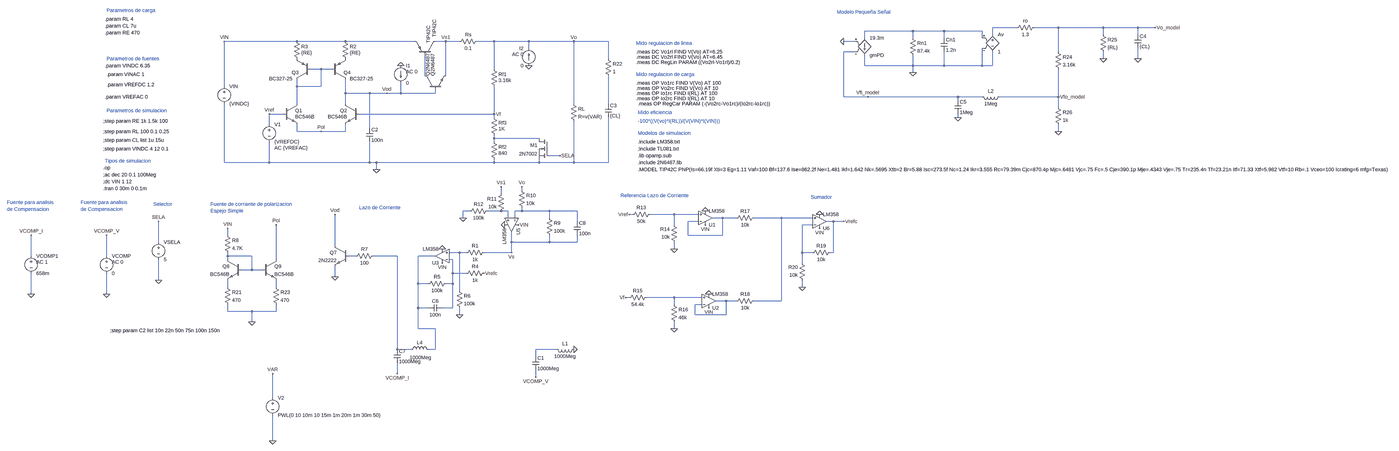
[diagram p0: schematic Regulador_LDOA_v6.asc, whole sheet]
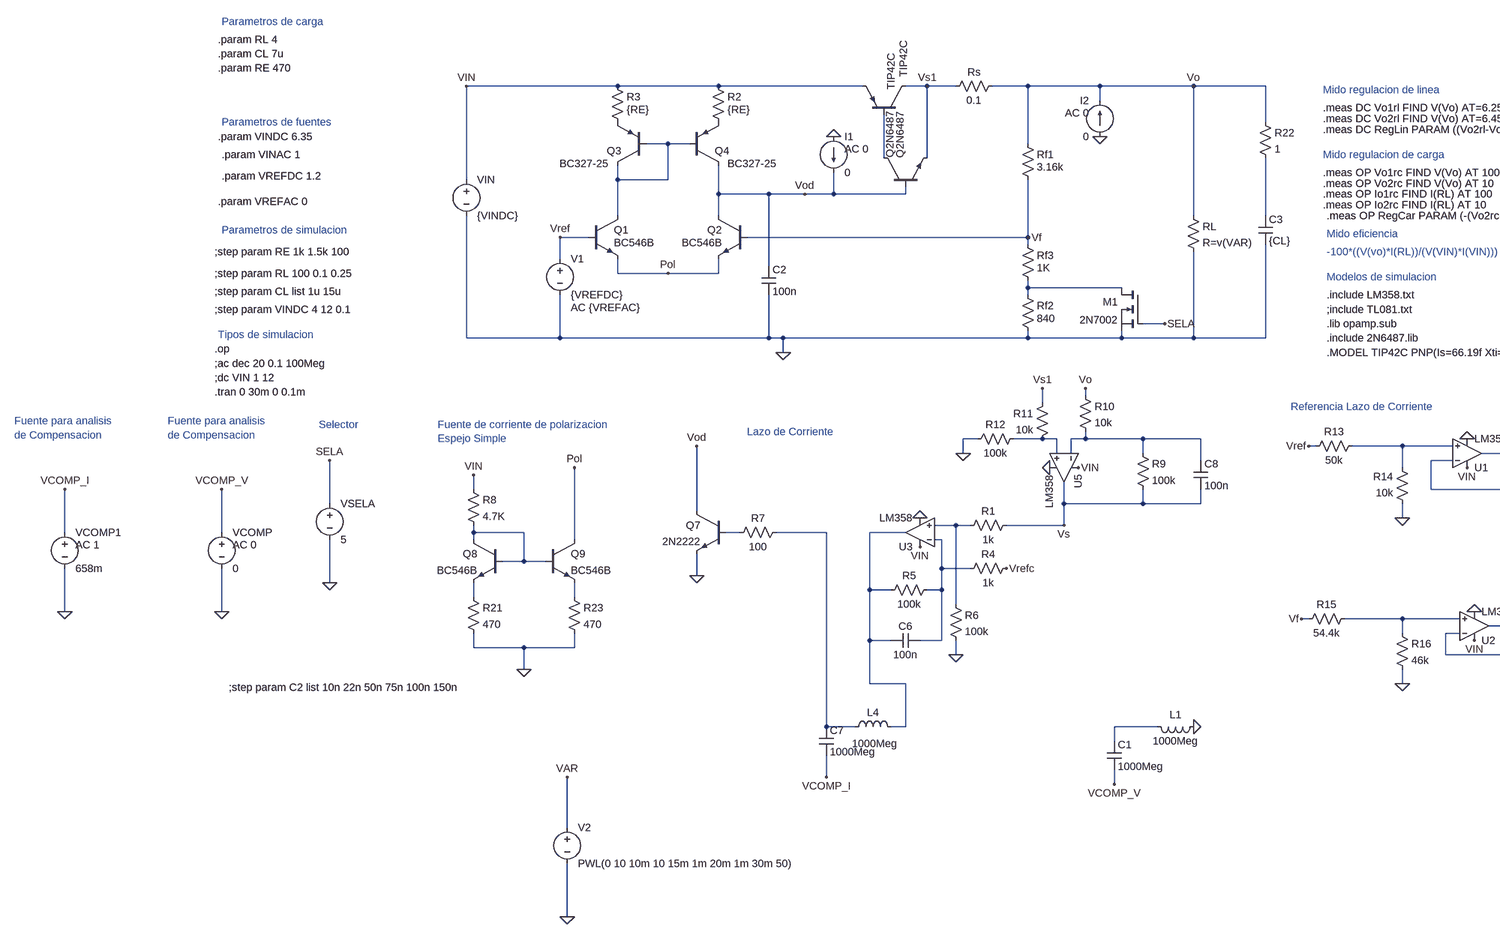
[diagram p1: schematic Regulador_LDOA_v6.asc, part, row 1 of 1, column 1 of 2]
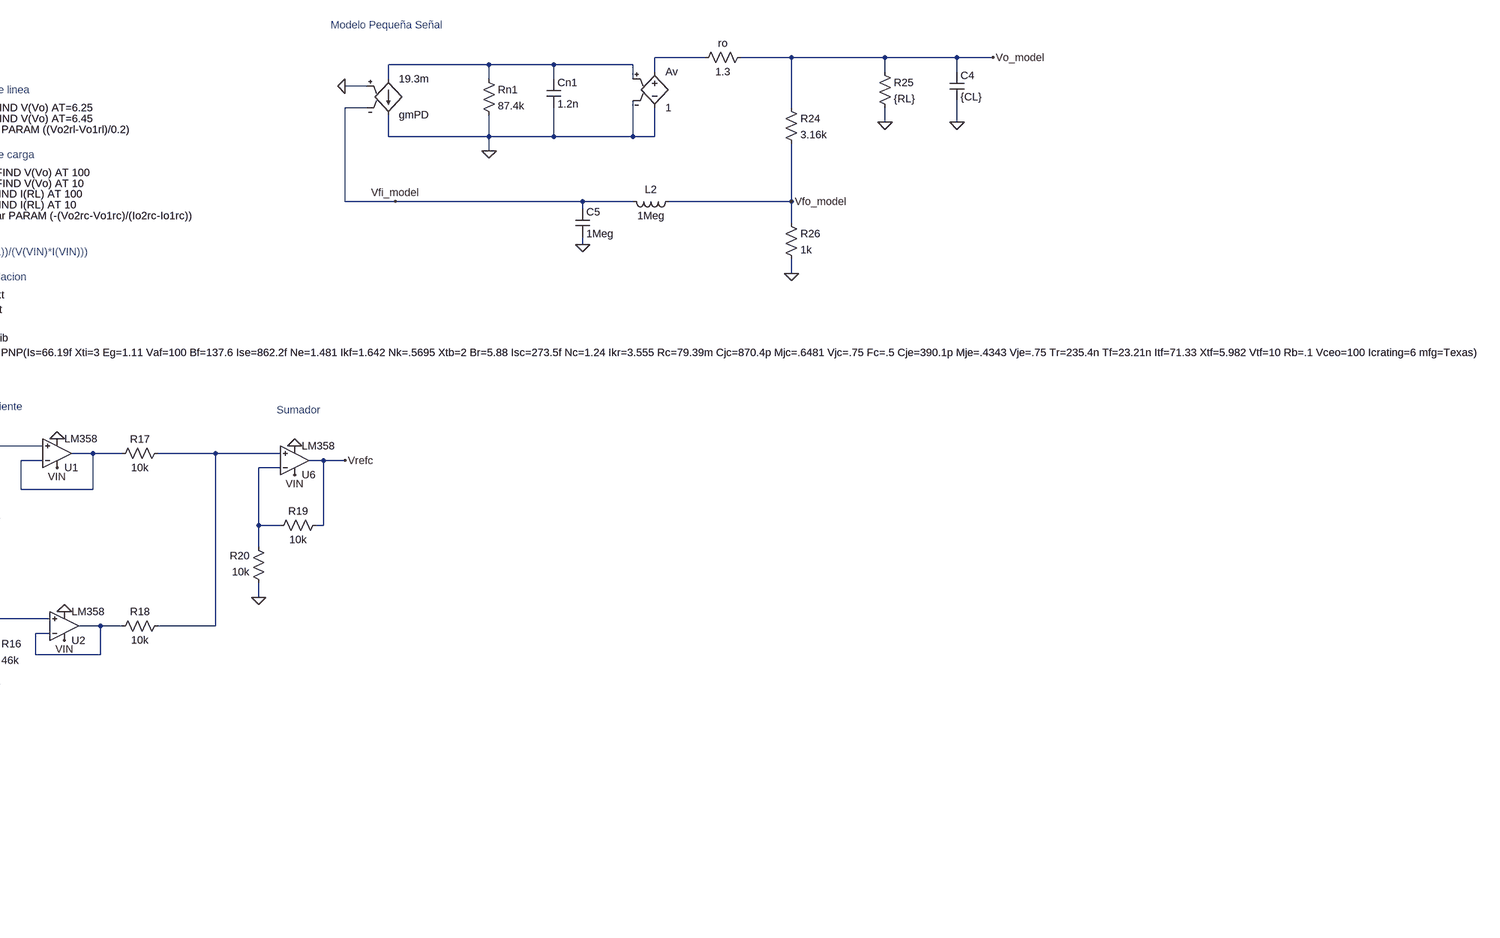
[diagram p2: schematic Regulador_LDOA_v6.asc, part, row 1 of 1, column 2 of 2]
Regulador_LDOA_v6.asc, the LTspice schematic file:
Version 4
SHEET 1 2316 856
WIRE -5360 -2448 -5472 -2448
WIRE -5168 -2448 -5280 -2448
WIRE -4960 -2448 -5168 -2448
WIRE -4800 -2448 -4960 -2448
WIRE -4720 -2448 -4800 -2448
WIRE -5840 -2432 -6064 -2432
WIRE -5696 -2432 -5840 -2432
WIRE -5520 -2432 -5696 -2432
WIRE -5472 -2416 -5472 -2448
WIRE -4960 -2416 -4960 -2448
WIRE -4800 -2416 -4800 -2448
WIRE -6064 -2400 -6064 -2432
WIRE -5840 -2400 -5840 -2432
WIRE -5696 -2400 -5696 -2432
WIRE -5520 -2400 -5520 -2432
WIRE -8688 -2384 -9024 -2384
WIRE -8464 -2384 -8688 -2384
WIRE -8144 -2384 -8464 -2384
WIRE -8000 -2384 -8048 -2384
WIRE -7936 -2384 -8000 -2384
WIRE -7776 -2384 -7856 -2384
WIRE -7616 -2384 -7776 -2384
WIRE -7408 -2384 -7616 -2384
WIRE -7248 -2384 -7408 -2384
WIRE -6112 -2384 -6160 -2384
WIRE -7616 -2352 -7616 -2384
WIRE -6112 -2336 -6160 -2336
WIRE -5168 -2336 -5168 -2448
WIRE -7248 -2304 -7248 -2384
WIRE -4960 -2304 -4960 -2336
WIRE -4800 -2304 -4800 -2352
WIRE -6064 -2272 -6064 -2320
WIRE -5840 -2272 -5840 -2320
WIRE -5840 -2272 -6064 -2272
WIRE -5696 -2272 -5696 -2336
WIRE -5696 -2272 -5840 -2272
WIRE -5520 -2272 -5520 -2352
WIRE -5520 -2272 -5696 -2272
WIRE -5472 -2272 -5472 -2336
WIRE -5472 -2272 -5520 -2272
WIRE -8576 -2256 -8624 -2256
WIRE -8528 -2256 -8576 -2256
WIRE -7776 -2256 -7776 -2384
WIRE -5840 -2240 -5840 -2272
WIRE -8096 -2224 -8096 -2320
WIRE -8000 -2224 -8000 -2384
WIRE -9024 -2176 -9024 -2384
WIRE -8688 -2176 -8688 -2208
WIRE -8576 -2176 -8576 -2256
WIRE -8576 -2176 -8688 -2176
WIRE -8464 -2144 -8464 -2208
WIRE -8352 -2144 -8464 -2144
WIRE -8272 -2144 -8352 -2144
WIRE -8208 -2144 -8208 -2192
WIRE -8208 -2144 -8272 -2144
WIRE -8048 -2144 -8048 -2160
WIRE -8048 -2144 -8208 -2144
WIRE -6160 -2128 -6160 -2336
WIRE -6048 -2128 -6160 -2128
WIRE -5632 -2128 -6048 -2128
WIRE -5520 -2128 -5632 -2128
WIRE -5168 -2128 -5168 -2256
WIRE -5168 -2128 -5440 -2128
WIRE -5632 -2112 -5632 -2128
WIRE -8688 -2096 -8688 -2176
WIRE -8464 -2096 -8464 -2144
WIRE -7408 -2096 -7408 -2384
WIRE -7248 -2096 -7248 -2224
WIRE -5168 -2080 -5168 -2128
WIRE -8752 -2048 -8816 -2048
WIRE -7776 -2048 -7776 -2176
WIRE -7776 -2048 -8400 -2048
WIRE -7776 -2032 -7776 -2048
WIRE -5632 -2032 -5632 -2048
WIRE -8816 -2000 -8816 -2048
WIRE -8352 -1984 -8352 -2144
WIRE -8688 -1968 -8688 -2000
WIRE -8576 -1968 -8688 -1968
WIRE -8464 -1968 -8464 -2000
WIRE -8464 -1968 -8576 -1968
WIRE -5168 -1968 -5168 -2000
WIRE -7776 -1936 -7776 -1952
WIRE -7568 -1936 -7776 -1936
WIRE -7776 -1920 -7776 -1936
WIRE -7472 -1856 -7520 -1856
WIRE -9024 -1824 -9024 -2096
WIRE -8816 -1824 -8816 -1920
WIRE -8816 -1824 -9024 -1824
WIRE -8352 -1824 -8352 -1920
WIRE -8352 -1824 -8816 -1824
WIRE -8320 -1824 -8352 -1824
WIRE -7776 -1824 -7776 -1840
WIRE -7776 -1824 -8320 -1824
WIRE -7568 -1824 -7568 -1840
WIRE -7568 -1824 -7776 -1824
WIRE -7408 -1824 -7408 -2016
WIRE -7408 -1824 -7568 -1824
WIRE -7248 -1824 -7248 -2032
WIRE -7248 -1824 -7408 -1824
WIRE -8320 -1792 -8320 -1824
WIRE -7648 -1696 -7648 -1712
WIRE -7744 -1680 -7744 -1712
WIRE -7888 -1600 -7920 -1600
WIRE -7744 -1600 -7808 -1600
WIRE -7712 -1600 -7744 -1600
WIRE -7648 -1600 -7648 -1616
WIRE -7648 -1600 -7680 -1600
WIRE -7520 -1600 -7648 -1600
WIRE -7392 -1600 -7520 -1600
WIRE -7136 -1584 -7152 -1584
WIRE -6944 -1584 -7056 -1584
WIRE -6832 -1584 -6944 -1584
WIRE -7920 -1568 -7920 -1600
WIRE -7712 -1568 -7712 -1600
WIRE -7680 -1568 -7680 -1600
WIRE -7520 -1568 -7520 -1600
WIRE -6720 -1568 -6768 -1568
WIRE -6656 -1568 -6720 -1568
WIRE -6448 -1568 -6576 -1568
WIRE -6304 -1568 -6448 -1568
WIRE -7392 -1552 -7392 -1600
WIRE -6832 -1552 -6880 -1552
WIRE -6208 -1552 -6240 -1552
WIRE -6160 -1552 -6208 -1552
WIRE -6944 -1536 -6944 -1584
WIRE -6304 -1536 -6352 -1536
WIRE -9008 -1488 -9008 -1520
WIRE -6880 -1488 -6880 -1552
WIRE -6720 -1488 -6720 -1568
WIRE -6720 -1488 -6880 -1488
WIRE -9328 -1456 -9328 -1552
WIRE -7696 -1456 -7696 -1504
WIRE -7520 -1456 -7520 -1488
WIRE -7520 -1456 -7696 -1456
WIRE -7392 -1456 -7392 -1488
WIRE -7392 -1456 -7520 -1456
WIRE -8512 -1440 -8512 -1584
WIRE -6944 -1424 -6944 -1456
WIRE -7936 -1408 -7984 -1408
WIRE -7904 -1408 -7936 -1408
WIRE -7696 -1408 -7696 -1456
WIRE -7696 -1408 -7824 -1408
WIRE -6352 -1408 -6352 -1536
WIRE -6304 -1408 -6352 -1408
WIRE -6208 -1408 -6208 -1552
WIRE -6208 -1408 -6224 -1408
WIRE -9920 -1392 -9920 -1488
WIRE -9568 -1392 -9568 -1488
WIRE -9008 -1392 -9008 -1408
WIRE -8896 -1392 -9008 -1392
WIRE -8416 -1392 -8448 -1392
WIRE -8224 -1392 -8336 -1392
WIRE -8048 -1392 -8128 -1392
WIRE -9008 -1376 -9008 -1392
WIRE -8784 -1376 -8784 -1536
WIRE -7968 -1376 -7984 -1376
WIRE -6352 -1360 -6352 -1408
WIRE -8896 -1328 -8896 -1392
WIRE -8896 -1328 -8944 -1328
WIRE -8848 -1328 -8896 -1328
WIRE -7968 -1312 -7968 -1376
WIRE -7904 -1312 -7968 -1312
WIRE -8512 -1296 -8512 -1344
WIRE -9328 -1280 -9328 -1376
WIRE -8128 -1264 -8128 -1392
WIRE -8080 -1264 -8128 -1264
WIRE -7968 -1264 -7968 -1312
WIRE -7968 -1264 -8000 -1264
WIRE -9008 -1248 -9008 -1280
WIRE -8784 -1248 -8784 -1280
WIRE -6352 -1248 -6352 -1280
WIRE -7936 -1232 -7936 -1408
WIRE -9920 -1216 -9920 -1312
WIRE -9568 -1216 -9568 -1312
WIRE -7152 -1200 -7168 -1200
WIRE -6944 -1200 -7072 -1200
WIRE -6816 -1200 -6944 -1200
WIRE -6704 -1184 -6752 -1184
WIRE -6656 -1184 -6704 -1184
WIRE -6448 -1184 -6448 -1568
WIRE -6448 -1184 -6576 -1184
WIRE -6944 -1168 -6944 -1200
WIRE -6816 -1168 -6848 -1168
WIRE -8128 -1152 -8128 -1264
WIRE -8080 -1152 -8128 -1152
WIRE -7968 -1152 -7968 -1264
WIRE -7968 -1152 -8016 -1152
WIRE -9008 -1136 -9008 -1168
WIRE -8896 -1136 -9008 -1136
WIRE -8784 -1136 -8784 -1168
WIRE -8784 -1136 -8896 -1136
WIRE -7936 -1120 -7936 -1152
WIRE -6848 -1120 -6848 -1168
WIRE -6704 -1120 -6704 -1184
WIRE -6704 -1120 -6848 -1120
WIRE -8896 -1088 -8896 -1136
WIRE -8128 -1056 -8128 -1152
WIRE -8048 -1056 -8128 -1056
WIRE -6944 -1056 -6944 -1088
WIRE -8224 -960 -8224 -1392
WIRE -8160 -960 -8224 -960
WIRE -8048 -960 -8048 -1056
WIRE -8048 -960 -8080 -960
WIRE -7488 -960 -7584 -960
WIRE -7584 -928 -7584 -960
WIRE -8224 -848 -8224 -896
WIRE -7584 -832 -7584 -864
WIRE -8800 -736 -8800 -848
WIRE -8800 -528 -8800 -656
FLAG -8320 -1792 0
FLAG -7408 -2384 Vo
FLAG -8816 -2048 Vref
FLAG -9024 -2384 VIN
FLAG -7776 -2048 Vf
FLAG -8000 -2384 Vs1
FLAG -7936 -1120 0
FLAG -8272 -2144 Vod
FLAG -7824 -1312 Vrefc
FLAG -7920 -1568 0
FLAG -6352 -1248 0
FLAG -6944 -1056 0
FLAG -6944 -1424 0
FLAG -7472 -1856 SELA
FLAG -9328 -1552 SELA
FLAG -9328 -1280 0
FLAG -6160 -1552 Vrefc
FLAG -7696 -1408 Vs
FLAG -8512 -1296 0
FLAG -8576 -1968 Pol
FLAG -8784 -1536 Pol
FLAG -7584 -832 VCOMP_V
FLAG -9568 -1488 VCOMP_V
FLAG -9568 -1216 0
FLAG -4960 -2304 0
FLAG -4800 -2304 0
FLAG -5168 -1968 0
FLAG -5840 -2240 0
FLAG -5168 -2128 Vfo_model
FLAG -6048 -2128 Vfi_model
FLAG -4720 -2448 Vo_model
FLAG -8896 -1088 0
FLAG -8208 -2272 0
FLAG -7616 -2272 0
FLAG -6160 -2384 0
FLAG -5632 -2032 0
FLAG -7744 -1712 Vs1
FLAG -7648 -1712 Vo
FLAG -8512 -1584 Vod
FLAG -7152 -1584 Vref
FLAG -7168 -1200 Vf
FLAG -8224 -848 VCOMP_I
FLAG -9920 -1488 VCOMP_I
FLAG -9920 -1216 0
FLAG -6272 -1584 0
FLAG -6272 -1520 VIN
FLAG -6800 -1600 0
FLAG -6800 -1536 VIN
FLAG -6784 -1216 0
FLAG -6784 -1152 VIN
FLAG -8016 -1424 0
FLAG -8016 -1360 VIN
FLAG -7728 -1536 0
FLAG -7664 -1536 VIN
FLAG -9008 -1520 VIN
FLAG -7408 -960 0
FLAG -8800 -528 0
FLAG -8800 -848 VAR
DATAFLAG -7536 -2384 ""
DATAFLAG -7584 -960 ""
SYMBOL pnp -8624 -2208 R180
WINDOW 3 84 4 Left 2
SYMATTR Value BC327-25
SYMATTR InstName Q3
SYMBOL pnp -8528 -2208 M180
WINDOW 3 84 4 Left 2
SYMATTR Value BC327-25
SYMATTR InstName Q4
SYMBOL npn -8752 -2096 R0
WINDOW 3 56 60 Left 2
SYMATTR Value BC546B
SYMATTR InstName Q1
SYMBOL npn -8400 -2096 M0
WINDOW 3 56 60 Left 2
SYMATTR Value BC546B
SYMATTR InstName Q2
SYMBOL pnp -8048 -2320 M270
WINDOW 3 84 4 Left 2
SYMATTR Value TIP42C
SYMATTR InstName TIP42C
SYMBOL npn -8096 -2160 R270
WINDOW 3 65 14 Left 2
WINDOW 0 64 36 Left 2
SYMATTR Value Q2N6487
SYMATTR InstName Q2N6487
SYMBOL res -7792 -2272 R0
WINDOW 3 36 68 Left 2
SYMATTR Value 3.16k
SYMATTR InstName Rf1
SYMBOL res -7792 -1936 R0
WINDOW 3 36 68 Left 2
SYMATTR Value 840
SYMATTR InstName Rf2
SYMBOL res -7424 -2112 R0
SYMATTR InstName RL
SYMATTR Value R=v(VAR)
SYMBOL voltage -8816 -2016 R0
WINDOW 123 24 124 Left 2
WINDOW 39 0 0 Left 2
SYMATTR Value2 AC {VREFAC}
SYMATTR InstName V1
SYMATTR Value {VREFDC}
SYMBOL voltage -9024 -2192 R0
WINDOW 123 24 124 Left 2
WINDOW 39 0 0 Left 2
SYMATTR InstName VIN
SYMATTR Value {VINDC}
SYMBOL res -8704 -2400 R0
WINDOW 3 36 68 Left 2
SYMATTR Value {RE}
SYMATTR InstName R3
SYMBOL res -8480 -2400 R0
WINDOW 3 36 68 Left 2
SYMATTR Value {RE}
SYMATTR InstName R2
SYMBOL cap -7264 -2096 R0
SYMATTR InstName C3
SYMATTR Value {CL}
SYMBOL res -7840 -2400 R90
WINDOW 0 0 56 VBottom 2
WINDOW 3 32 56 VTop 2
SYMATTR InstName Rs
SYMATTR Value 0.1
SYMBOL res -7808 -1424 R90
WINDOW 0 0 56 VBottom 2
WINDOW 3 32 56 VTop 2
SYMATTR InstName R1
SYMATTR Value 1k
SYMBOL res -7808 -1328 R90
WINDOW 0 0 56 VBottom 2
WINDOW 3 32 56 VTop 2
SYMATTR InstName R4
SYMATTR Value 1k
SYMBOL res -7984 -1280 R90
WINDOW 0 0 56 VBottom 2
WINDOW 3 32 56 VTop 2
SYMATTR InstName R5
SYMATTR Value 100k
SYMBOL res -7952 -1248 R0
SYMATTR InstName R6
SYMATTR Value 100k
SYMBOL npn -8448 -1440 M0
SYMATTR InstName Q7
SYMATTR Value 2N2222
SYMBOL res -7536 -1584 R0
SYMATTR InstName R9
SYMATTR Value 100k
SYMBOL res -7664 -1712 R0
SYMATTR InstName R10
SYMATTR Value 10k
SYMBOL res -7728 -1696 M0
SYMATTR InstName R11
SYMATTR Value 10k
SYMBOL res -7792 -1616 R90
WINDOW 0 0 56 VBottom 2
WINDOW 3 32 56 VTop 2
SYMATTR InstName R12
SYMATTR Value 100k
SYMBOL res -7040 -1600 R90
WINDOW 0 0 56 VBottom 2
WINDOW 3 32 56 VTop 2
SYMATTR InstName R13
SYMATTR Value 50k
SYMBOL res -6928 -1440 R180
WINDOW 0 36 76 Left 2
WINDOW 3 36 40 Left 2
SYMATTR InstName R14
SYMATTR Value 10k
SYMBOL res -7168 -1184 R270
WINDOW 0 32 56 VTop 2
WINDOW 3 0 56 VBottom 2
SYMATTR InstName R15
SYMATTR Value 54.4k
SYMBOL res -6960 -1184 R0
SYMATTR InstName R16
SYMATTR Value 46k
SYMBOL res -6560 -1584 R90
WINDOW 0 0 56 VBottom 2
WINDOW 3 32 56 VTop 2
SYMATTR InstName R17
SYMATTR Value 10k
SYMBOL res -6560 -1200 R90
WINDOW 0 0 56 VBottom 2
WINDOW 3 32 56 VTop 2
SYMATTR InstName R18
SYMATTR Value 10k
SYMBOL res -6208 -1424 R90
WINDOW 0 0 56 VBottom 2
WINDOW 3 32 56 VTop 2
SYMATTR InstName R19
SYMATTR Value 10k
SYMBOL res -6336 -1264 R180
WINDOW 0 36 76 Left 2
WINDOW 3 36 40 Left 2
SYMATTR InstName R20
SYMATTR Value 10k
SYMBOL res -7792 -2048 R0
WINDOW 3 36 68 Left 2
SYMATTR Value 1K
SYMATTR InstName Rf3
SYMBOL nmos -7520 -1936 M0
SYMATTR InstName M1
SYMATTR Value 2N7002
SYMBOL voltage -9328 -1472 R0
WINDOW 123 0 0 Left 2
WINDOW 39 0 0 Left 2
SYMATTR InstName VSELA
SYMATTR Value 5
SYMBOL res -8320 -1408 R90
WINDOW 0 0 56 VBottom 2
WINDOW 3 32 56 VTop 2
SYMATTR InstName R7
SYMATTR Value 100
SYMBOL npn -8944 -1376 M0
SYMATTR InstName Q8
SYMATTR Value BC546B
SYMBOL res -9024 -1504 R0
SYMATTR InstName R8
SYMATTR Value 4.7K
SYMBOL ind -7392 -976 R90
WINDOW 0 5 56 VBottom 2
WINDOW 3 32 56 VTop 2
SYMATTR InstName L1
SYMATTR Value 1000Meg
SYMBOL cap -7600 -928 R0
SYMATTR InstName C1
SYMATTR Value 1000Meg
SYMBOL voltage -9568 -1408 R0
WINDOW 123 24 44 Left 2
WINDOW 39 0 0 Left 2
SYMATTR Value2 AC 0
SYMATTR InstName VCOMP
SYMATTR Value 0
SYMBOL g2 -6064 -2304 M180
SYMATTR InstName gmPD
SYMATTR Value 19.3m
SYMBOL res -5856 -2416 R0
SYMATTR InstName Rn1
SYMATTR Value 87.4k
SYMBOL cap -5712 -2400 R0
SYMATTR InstName Cn1
SYMATTR Value 1.2n
SYMBOL e -5472 -2432 R0
SYMATTR InstName Av
SYMATTR Value 1
SYMBOL res -5264 -2464 R90
WINDOW 0 0 56 VBottom 2
WINDOW 3 32 56 VTop 2
SYMATTR InstName ro
SYMATTR Value 1.3
SYMBOL res -5184 -2352 R0
SYMATTR InstName R24
SYMATTR Value 3.16k
SYMBOL res -4976 -2432 R0
SYMATTR InstName R25
SYMATTR Value {RL}
SYMBOL cap -4816 -2416 R0
SYMATTR InstName C4
SYMATTR Value {CL}
SYMBOL cap -5648 -2112 R0
SYMATTR InstName C5
SYMATTR Value 1Meg
SYMBOL ind -5424 -2144 R90
WINDOW 0 5 56 VBottom 2
WINDOW 3 32 56 VTop 2
SYMATTR InstName L2
SYMATTR Value 1Meg
SYMBOL res -5184 -2096 R0
SYMATTR InstName R26
SYMATTR Value 1k
SYMBOL npn -8848 -1376 R0
SYMATTR InstName Q9
SYMATTR Value BC546B
SYMBOL current -8208 -2272 R0
WINDOW 123 24 28 Left 2
WINDOW 39 0 0 Left 2
SYMATTR Value2 AC 0
SYMATTR InstName I1
SYMATTR Value 0
SYMBOL current -7616 -2272 R180
WINDOW 0 24 80 Left 2
WINDOW 3 24 0 Left 2
WINDOW 123 24 52 Left 2
WINDOW 39 0 0 Left 2
SYMATTR InstName I2
SYMATTR Value 0
SYMATTR Value2 AC 0
SYMBOL ind -8176 -944 R270
WINDOW 0 32 56 VTop 2
WINDOW 3 -6 60 VBottom 2
SYMATTR InstName L4
SYMATTR Value 1000Meg
SYMBOL cap -8240 -896 M180
WINDOW 0 24 56 Left 2
WINDOW 3 24 8 Left 2
SYMATTR InstName C7
SYMATTR Value 1000Meg
SYMBOL voltage -9920 -1408 R0
WINDOW 123 24 44 Left 2
WINDOW 39 0 0 Left 2
SYMATTR Value2 AC 1
SYMATTR InstName VCOMP1
SYMATTR Value 658m
SYMBOL cap -8368 -1984 R0
SYMATTR InstName C2
SYMATTR Value 100n
SYMBOL Opamps\\opamp2 -6272 -1488 M180
SYMATTR InstName U6
SYMATTR Value LM358
SYMBOL Opamps\\opamp2 -6800 -1504 M180
SYMATTR InstName U1
SYMATTR Value LM358
SYMBOL Opamps\\opamp2 -6784 -1120 M180
SYMATTR InstName U2
SYMATTR Value LM358
SYMBOL Opamps\\opamp2 -8016 -1328 R180
SYMATTR InstName U3
SYMATTR Value LM358
SYMBOL Opamps\\opamp2 -7632 -1536 R90
SYMATTR InstName U5
SYMATTR Value LM358
SYMBOL res -7264 -2320 R0
SYMATTR InstName R22
SYMATTR Value 1
SYMBOL res -9024 -1264 R0
SYMATTR InstName R21
SYMATTR Value 470
SYMBOL res -8800 -1264 R0
SYMATTR InstName R23
SYMATTR Value 470
SYMBOL cap -8016 -1168 R90
WINDOW 0 0 32 VBottom 2
WINDOW 3 32 32 VTop 2
SYMATTR InstName C6
SYMATTR Value 100n
SYMBOL cap -7408 -1552 R0
SYMATTR InstName C8
SYMATTR Value 100n
SYMBOL voltage -8800 -752 R0
WINDOW 123 0 0 Left 0
WINDOW 39 0 0 Left 0
SYMATTR InstName V2
SYMATTR Value PWL(0 10 10m 10 15m 1m 20m 1m 30m 50)
TEXT -9584 -1800 Left 2 !.op
TEXT -9584 -1768 Left 2 !;ac dec 20 0.1 100Meg
TEXT -9576 -2272 Left 2 !.param VINDC 6.35
TEXT -9568 -2232 Left 2 !.param VINAC 1
TEXT -9568 -2184 Left 2 !.param VREFDC 1.2
TEXT -9576 -2128 Left 2 !.param VREFAC 0
TEXT -9576 -2488 Left 2 !.param RL 4
TEXT -9584 -1736 Left 2 !;dc VIN 1 12
TEXT -9584 -2016 Left 2 !;step param RE 1k 1.5k 100
TEXT -9576 -2424 Left 2 !.param RE 470
TEXT -9584 -1968 Left 2 !;step param RL 100 0.1 0.25
TEXT -7120 -2376 Left 2 ;Mido regulacion de linea
TEXT -7120 -2336 Left 2 !.meas DC Vo1rl FIND V(Vo) AT=6.25
TEXT -7120 -2312 Left 2 !.meas DC Vo2rl FIND V(Vo) AT=6.45
TEXT -7120 -2288 Left 2 !.meas DC RegLin PARAM ((Vo2rl-Vo1rl)/0.2)
TEXT -7120 -2232 Left 2 ;Mido regulacion de carga
TEXT -7120 -2192 Left 2 !.meas OP Vo1rc FIND V(Vo) AT 100
TEXT -7120 -2168 Left 2 !.meas OP Vo2rc FIND V(Vo) AT 10
TEXT -7120 -2144 Left 2 !.meas OP Io1rc FIND I(RL) AT 100
TEXT -7120 -2120 Left 2 !.meas OP Io2rc FIND I(RL) AT 10
TEXT -7112 -2056 Left 2 ;Mido eficiencia
TEXT -7112 -2016 Left 2 ;-100*((V(vo)*I(RL))/(V(VIN)*I(VIN)))
TEXT -7112 -2096 Left 2 !.meas OP RegCar PARAM (-(Vo2rc-Vo1rc)/(Io2rc-Io1rc))
TEXT -9584 -1704 Left 2 !.tran 0 30m 0 0.1m
TEXT -8400 -1616 Left 2 ;Lazo de Corriente
TEXT -7112 -1888 Left 2 !;include TL081.txt
TEXT -7192 -1672 Left 2 ;Referencia Lazo de Corriente
TEXT -9584 -1888 Left 2 !;step param VINDC 4 12 0.1
TEXT -6312 -1664 Left 2 ;Sumador
TEXT -9352 -1632 Left 2 ;Selector
TEXT -7112 -1856 Left 2 !.lib opamp.sub
TEXT -9088 -1632 Left 2 ;Fuente de corriente de polarizacion\nEspejo Simple
TEXT -9688 -1640 Left 2 ;Fuente para analisis \nde Compensacion
TEXT -9576 -2456 Left 2 !.param CL 7u
TEXT -9568 -2528 Left 2 ;Parametros de carga
TEXT -9568 -2304 Left 2 ;Parametros de fuentes
TEXT -9568 -2064 Left 2 ;Parametros de simulacion
TEXT -6192 -2520 Left 2 ;Modelo Pequeña Señal
TEXT -7112 -1960 Left 2 ;Modelos de simulacion
TEXT -9576 -1832 Left 2 ;Tipos de simulacion
TEXT -9584 -1928 Left 2 !;step param CL list 1u 15u
TEXT -9552 -1048 Left 2 !;step param C2 list 10n 22n 50n 75n 100n 150n
TEXT -10032 -1640 Left 2 ;Fuente para analisis \nde Compensacion
TEXT -7112 -1792 Left 2 !.MODEL TIP42C PNP(Is=66.19f Xti=3 Eg=1.11 Vaf=100 Bf=137.6 Ise=862.2f Ne=1.481 Ikf=1.642 Nk=.5695 Xtb=2 Br=5.88 Isc=273.5f Nc=1.24 Ikr=3.555 Rc=79.39m Cjc=870.4p Mjc=.6481 Vjc=.75 Fc=.5 Cje=390.1p Mje=.4343 Vje=.75 Tr=235.4n Tf=23.21n Itf=71.33 Xtf=5.982 Vtf=10 Rb=.1 Vceo=100 Icrating=6 mfg=Texas)
TEXT -7112 -1824 Left 2 !.include 2N6487.lib
TEXT -7112 -1920 Left 2 !.include LM358.txt

The netlist it stands for:
* Regulador_LDOA_v6.asc
Q3 N003 N003 P001 0 BC327-25
Q4 Vod N003 P002 0 BC327-25
Q1 N003 Vref Pol 0 BC546B
Q2 Vod Vf Pol 0 BC546B
Q§TIP42C Vs1 N004 VIN 0 TIP42C
Q2N6487 N004 Vod Vs1 0 Q2N6487
Rf1 Vo Vf 3.16k
Rf2 N006 0 840
RL Vo 0 R=v(VAR)
V1 Vref 0 {VREFDC} AC {VREFAC}
VIN VIN 0 {VINDC}
R3 VIN P001 {RE}
R2 VIN P002 {RE}
C3 N005 0 {CL}
Rs Vo Vs1 0.1
R1 Vs N013 1k
R4 Vrefc N018 1k
R5 N018 N017 100k
R6 N013 0 100k
Q7 Vod N015 0 0 2N2222
R9 N008 Vs 100k
R10 Vo N008 10k
R11 Vs1 N007 10k
R12 N007 0 100k
R13 N009 Vref 50k
R14 0 N009 10k
R15 Vf N021 54.4k
R16 N021 0 46k
R17 N011 N010 10k
R18 N011 N022 10k
R19 Vrefc N012 10k
R20 0 N012 10k
Rf3 Vf N006 1K
M1 N006 SELA 0 0 2N7002
VSELA SELA 0 5
R7 N016 N015 100
Q8 N014 N014 N019 0 BC546B
R8 VIN N014 4.7K
L1 0 N023 1000Meg
C1 N023 VCOMP_V 1000Meg
VCOMP VCOMP_V 0 0 AC 0
gmPD N002 0 0 Vfi_model 19.3m
Rn1 N002 0 87.4k
Cn1 N002 0 1.2n
E§Av N001 0 N002 0 1
ro Vo_model N001 1.3
R24 Vo_model Vfo_model 3.16k
R25 Vo_model 0 {RL}
C4 Vo_model 0 {CL}
C5 Vfi_model 0 1Meg
L2 Vfo_model Vfi_model 1Meg
R26 Vfo_model 0 1k
Q9 Pol N014 N020 0 BC546B
I1 0 Vod 0 AC 0
I2 0 Vo 0 AC 0
L4 N016 N017 1000Meg
C7 VCOMP_I N016 1000Meg
VCOMP1 VCOMP_I 0 658m AC 1
C2 Vod 0 100n
XU6 N011 N012 VIN 0 Vrefc LM358  ; pins In+ In- V+ V- OUT
XU1 N009 N010 VIN 0 N010 LM358  ; pins In+ In- V+ V- OUT
XU2 N021 N022 VIN 0 N022 LM358  ; pins In+ In- V+ V- OUT
XU3 N013 N018 VIN 0 N017 LM358  ; pins In+ In- V+ V- OUT
XU5 N007 N008 VIN 0 Vs LM358  ; pins In+ In- V+ V- OUT
R22 Vo N005 1
R21 N019 0 470
R23 N020 0 470
C6 N018 N017 100n
C8 N008 Vs 100n
V2 VAR 0 PWL(0 10 10m 10 15m 1m 20m 1m 30m 50)
.model NPN NPN
.model PNP PNP
.lib standard.bjt
.model NMOS NMOS
.model PMOS PMOS
.lib standard.mos
.op
;ac dec 20 0.1 100Meg
.param VINDC 6.35
.param VINAC 1
.param VREFDC 1.2
.param VREFAC 0
.param RL 4
;dc VIN 1 12
;step param RE 1k 1.5k 100
.param RE 470
;step param RL 100 0.1 0.25
* Mido regulacion de linea
.meas DC Vo1rl FIND V(Vo) AT=6.25
.meas DC Vo2rl FIND V(Vo) AT=6.45
.meas DC RegLin PARAM ((Vo2rl-Vo1rl)/0.2)
* Mido regulacion de carga
.meas OP Vo1rc FIND V(Vo) AT 100
.meas OP Vo2rc FIND V(Vo) AT 10
.meas OP Io1rc FIND I(RL) AT 100
.meas OP Io2rc FIND I(RL) AT 10
* Mido eficiencia
* -100*((V(vo)*I(RL))/(V(VIN)*I(VIN)))
.meas OP RegCar PARAM (-(Vo2rc-Vo1rc)/(Io2rc-Io1rc))
.tran 0 30m 0 0.1m
* Lazo de Corriente
;include TL081.txt
* Referencia Lazo de Corriente
;step param VINDC 4 12 0.1
* Sumador
* Selector
.lib opamp.sub
* Fuente de corriente de polarizacion
* Espejo Simple
* Fuente para analisis
* de Compensacion
.param CL 7u
* Parametros de carga
* Parametros de fuentes
* Parametros de simulacion
* Modelo Pequeña Señal
* Modelos de simulacion
* Tipos de simulacion
;step param CL list 1u 15u
;step param C2 list 10n 22n 50n 75n 100n 150n
* Fuente para analisis
* de Compensacion
.MODEL TIP42C PNP(Is=66.19f Xti=3 Eg=1.11 Vaf=100 Bf=137.6 Ise=862.2f Ne=1.481 Ikf=1.642 Nk=.5695 Xtb=2 Br=5.88 Isc=273.5f Nc=1.24 Ikr=3.555 Rc=79.39m Cjc=870.4p Mjc=.6481 Vjc=.75 Fc=.5 Cje=390.1p Mje=.4343 Vje=.75 Tr=235.4n Tf=23.21n Itf=71.33 Xtf=5.982 Vtf=10 Rb=.1 Vceo=100 Icrating=6 mfg=Texas)
.include 2N6487.lib
.include LM358.txt
.backanno
.end